# Altium schematic sheet Safety Loop.SchDoc
size A4; SheetNumber: 4; SheetTotal: 11
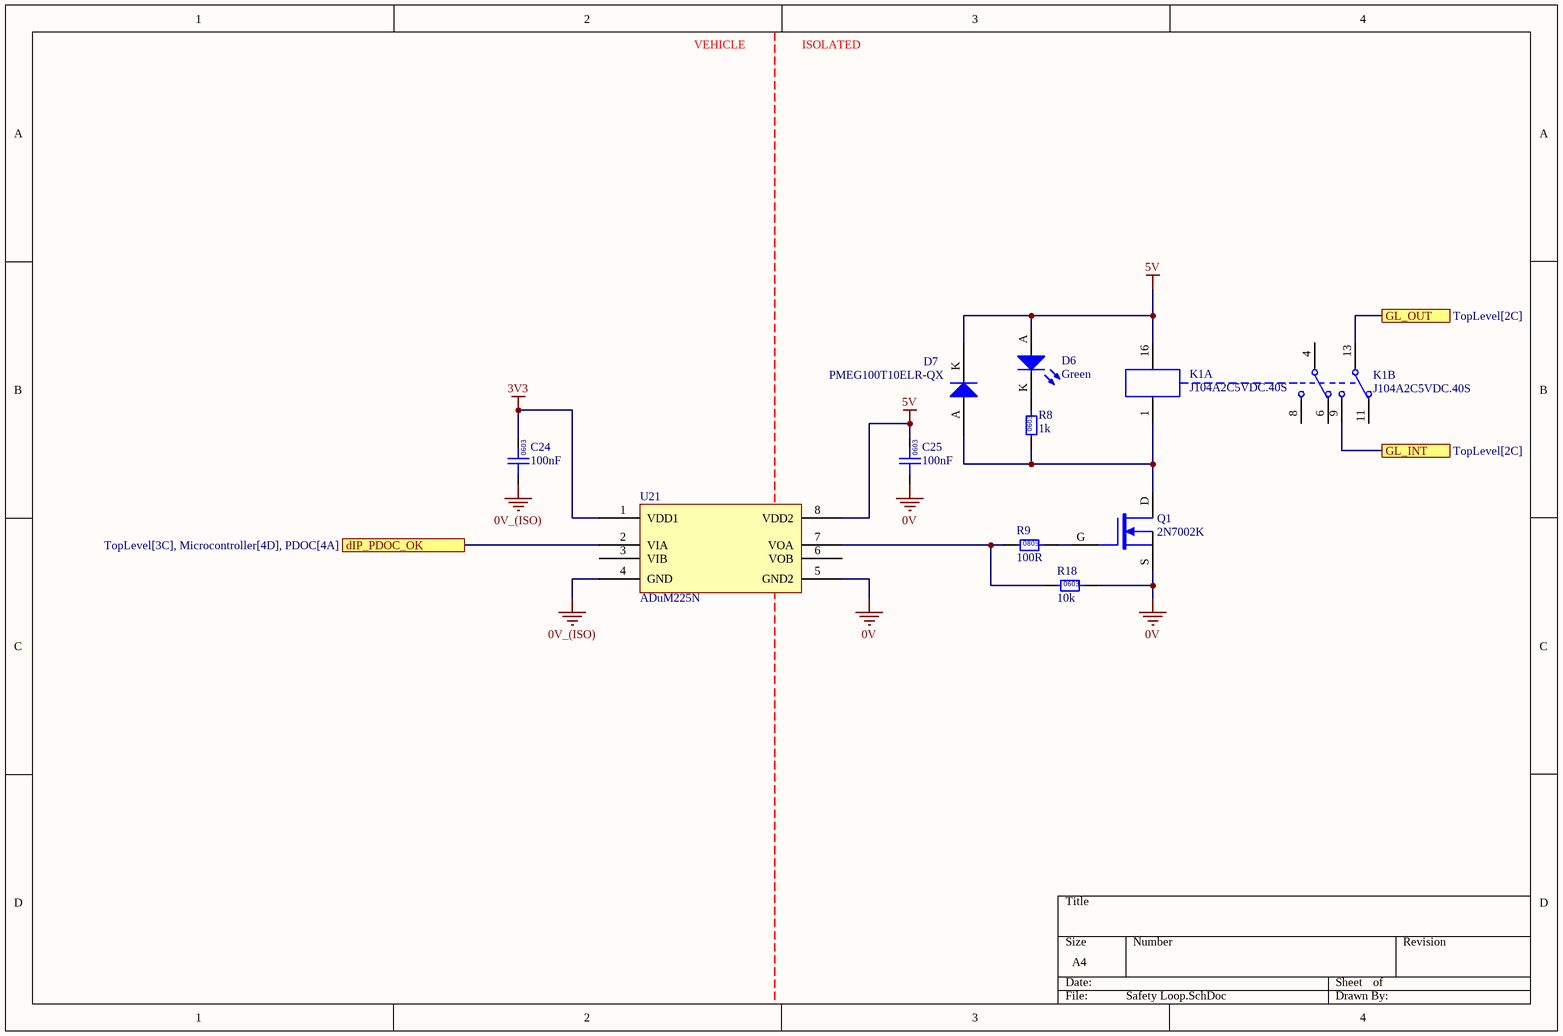
[diagram p0: Safety Loop.SchDoc]

## Parts
C24  100nF  [0603]
C25  100nF  [0603]
D6  Green  [0805 LED]
D7  PMEG100T10ELR-QX  [SODFL350X110-2N]
K1  J104A2C5VDC.40S  [J104A2C5VDC.40S-Footprint-1]  (parts A,B of 2)
Q1  2N7002K  [2N7002K-Footprint-1]
R8  1k  [0603]
R9  100R  [0805]
R18  10k  [0603]
U21  ADuM225N  [AD-SOIC-8W]

## Ports
dIP_PDOC_OK (see TopLevel[3C], Microcontroller[4D], PDOC[4A]), GL_INT (see TopLevel[2C]), GL_OUT (see TopLevel[2C])

## Nets
0V: C25.1 Q1.S R18.2 U21.5(GND2)
0V_(ISO): C24.1 U21.4(GND)
3V3: C24.2 U21.1(VDD1)
5V: C25.2 D6.A D7.K K1.16 U21.8(VDD2)
dIP_PDOC_OK: U21.2(VIA) ; port dIP_PDOC_OK
GL_INT: K1.9 ; port GL_INT
GL_OUT: K1.13 ; port GL_OUT
NetD6_K: D6.K R8.2
NetD7_A: D7.A K1.1 Q1.D R8.1
NetQ1_G: Q1.G R9.2
NetR9_1: R9.1 R18.1 U21.7(VOA)

Not connected (* = marked no-connect by the designer): K1 4 6 8 11; U21 3(VIB) 6(VOB)

## Notes on the sheet
- VEHICLE
- ISOLATED
- (in symbol GCM188L81H104KA57D) 0603
- (in symbol RC0603FR-071KL) 0603
- (in symbol RC0603FR-0710KL) 0603
- (in symbol RC0805FR07100RL) 0805

## Library data of the parts
C24 C25 = GCM188L81H104KA57D: Manufacturer: muRata; Rated Voltage: 50V; Tolerance: ±10%; Material: MLCC; Temperature Rating: X8L; Part Number: GCM188L81H104KA57D; Value: 100nF; Digikey Part Number: 490-6049-1-ND
D6 = SML-210FTT86: Green LED Indication - Discrete 1.75V 0805 (2012 Metric); Manufacturer: ROHM Semiconductor; Part Number: SML-210FTT86; Colour: Green; Digikey Part Number: 511-1285-1-ND
D7 = CMP-004-00005-4: Diode 100 V 1A Surface Mount SOD-123W
K1 = CMP-008-00001-1: Relay Gen Purpose DPDT 3A 5V
Q1 = CMP-038-000000-2: 60V 380mA, NFET MOSTFET (Small Signal); Part Number: 2N7002K
R8 = RC0603FR-071KL: Manufacturer: YAGEO; Tolerance: 0.01; Rated Power: 0.1W; Part Number: RC0603FR-071KL; Value: 1k; Digikey Part Number: 311-1.00KHRCT-ND; Material: FR-07
R9 = RC0805FR07100RL: Manufacturer: YAGEO; Tolerance: 0.01; Rated Power: 0.125W; Part Number: RC0805FR07100RL; Value: 100R; Material: FR-07; Digikey Part Number: 311-100CRCT-ND
R18 = RC0603FR-0710KL: Manufacturer: YAGEO; Tolerance: 0.01; Rated Power: 0.1W; Part Number: RC0603FR-0710KL; Value: 10k; Material: FR-07; Digikey Part Number: 311-10.0KHRCT-ND
U21 = ADuM225N: DIGITAL ISOLATOR, DUAL CHANNEL; Manufacturer: Analogue Devices; Part Number: ADuM225N